# EAGLE design xenium-programmer-chip (EAGLE 9.6.2)
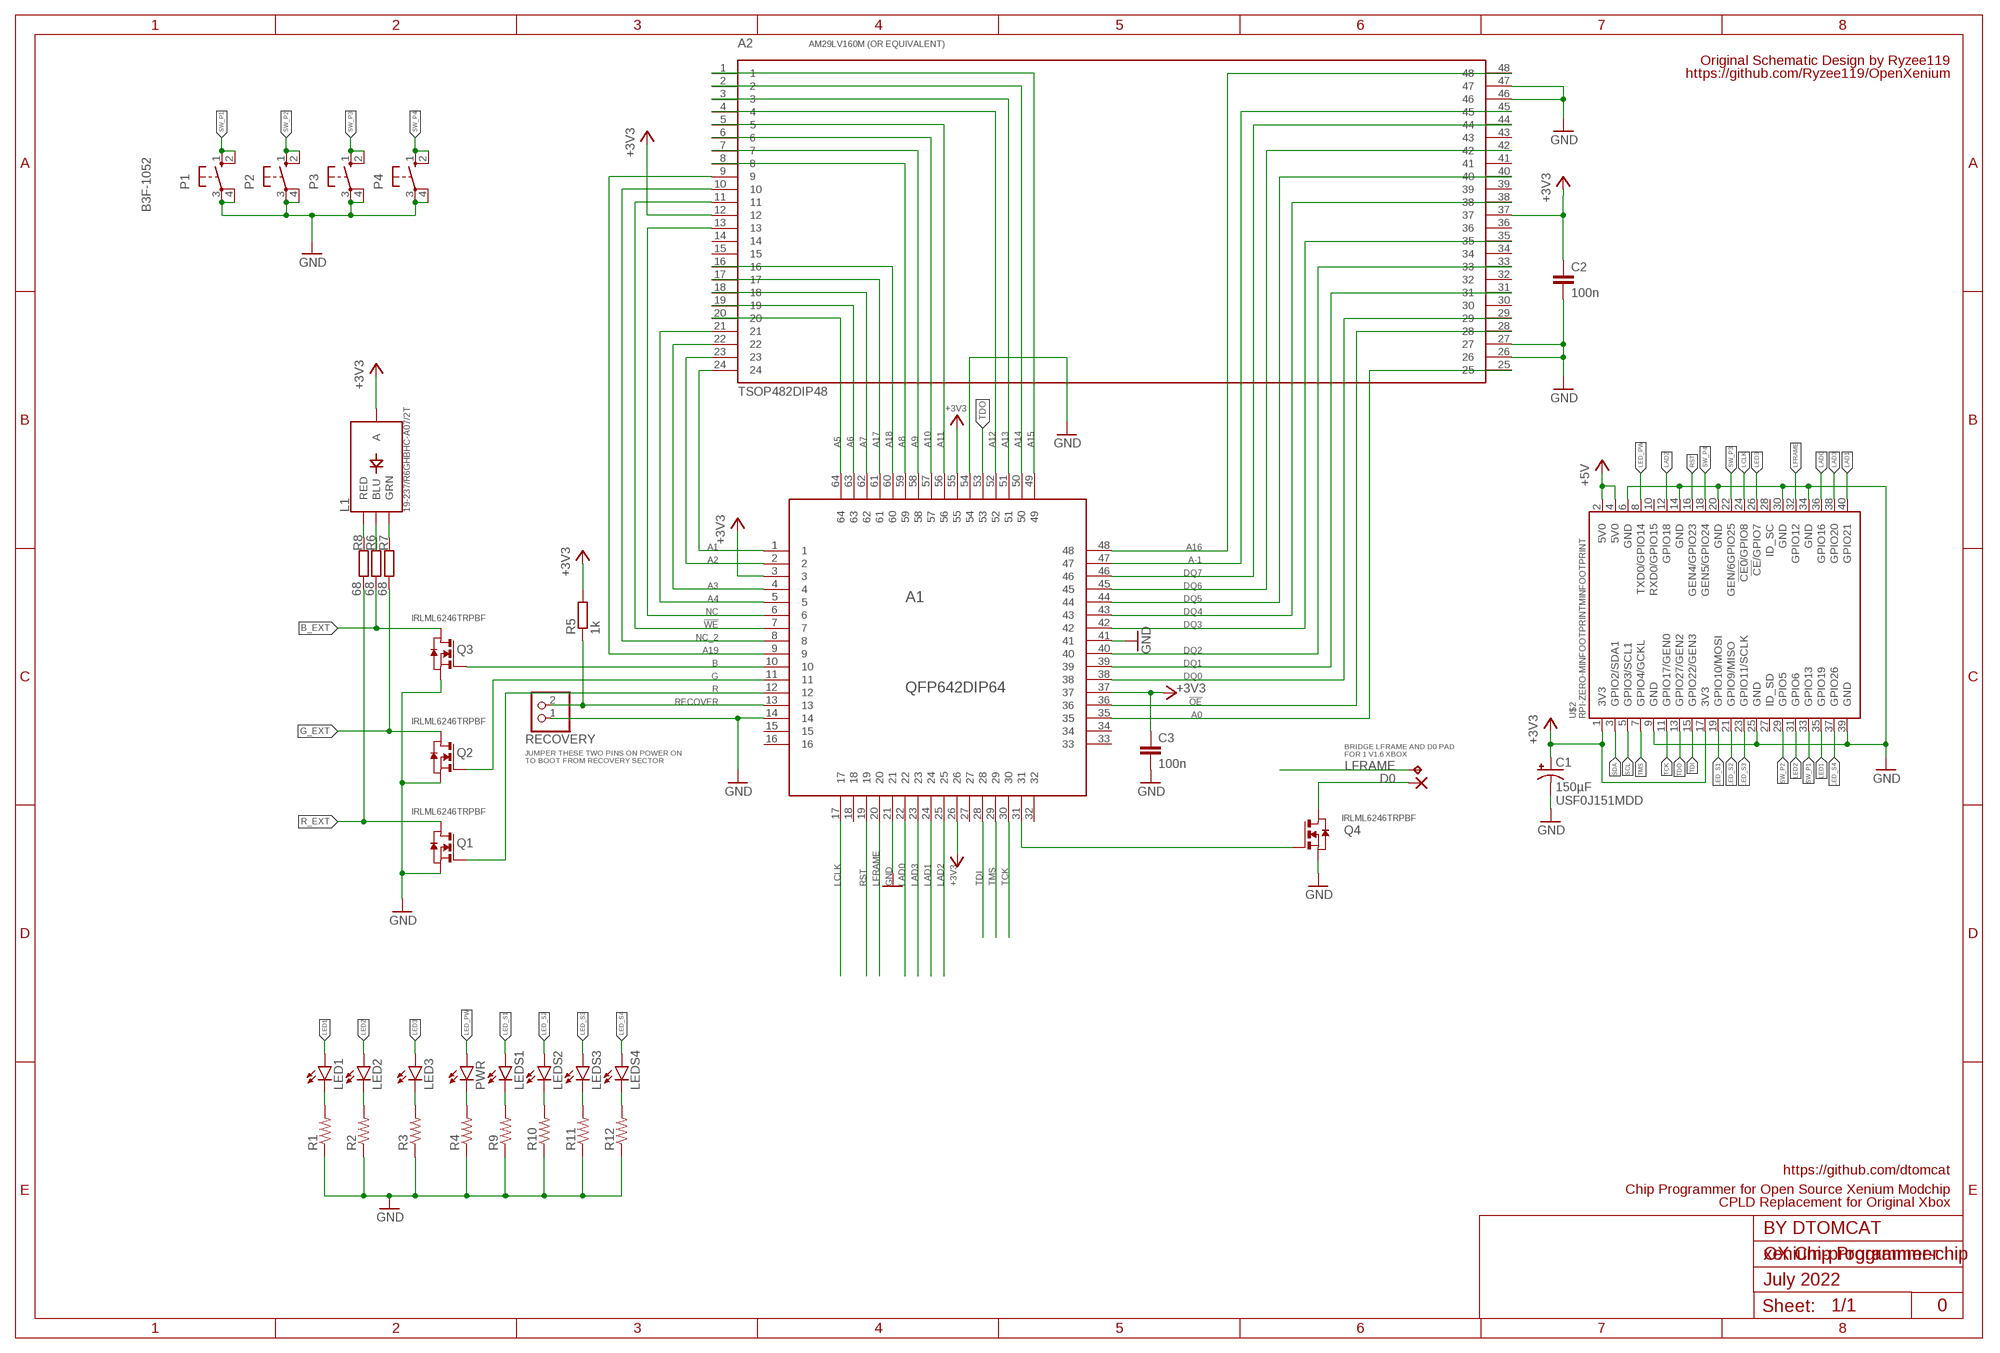
[diagram p0: schematic, sheet 1]

## Parts
A1  QFP642DIP64  [QFP642DIP64]
A2  TSOP482DIP48  [TSOP482DIP48]
C1  150µF  CPOL-USE3.5-8  [E3,5-8]
C2  100n  C-EUC0603  [C0603]
C3  100n  C-EUC0603  [C0603]
D0  SMD2  [SMD1,27-2,54]
L1  19-237/R6GHBHC-A07/2T  [4-SMD-R6GHBHC]
LED1  LEDCHIPLED_1206  [CHIPLED_1206]
LED2  LEDCHIPLED_1206  [CHIPLED_1206]
LED3  LEDCHIPLED_1206  [CHIPLED_1206]
LEDS1  LEDCHIPLED_1206  [CHIPLED_1206]
LEDS2  LEDCHIPLED_1206  [CHIPLED_1206]
LEDS3  LEDCHIPLED_1206  [CHIPLED_1206]
LEDS4  LEDCHIPLED_1206  [CHIPLED_1206]
P1  B3F-1052  [B3F-10XX]
P2  B3F-1052  [B3F-10XX]
P3  B3F-1052  [B3F-10XX]
P4  B3F-1052  [B3F-10XX]
PWR  LEDCHIPLED_1206  [CHIPLED_1206]
Q1  310mA/60V/1.6Ω  NMOSSOT23  [SOT-23]
Q2  310mA/60V/1.6Ω  NMOSSOT23  [SOT-23]
Q3  310mA/60V/1.6Ω  NMOSSOT23  [SOT-23]
Q4  310mA/60V/1.6Ω  NMOSSOT23  [SOT-23]
R1  R-US_R1206  [R1206]
R2  R-US_R1206  [R1206]
R3  R-US_R1206  [R1206]
R4  R-US_R1206  [R1206]
R5  1k  R-EU_R0603  [R0603]
R6  68  R-EU_R0603  [R0603]
R7  68  R-EU_R0603  [R0603]
R8  68  R-EU_R0603  [R0603]
R9  R-US_R1206  [R1206]
R10  R-US_R1206  [R1206]
R11  R-US_R1206  [R1206]
R12  R-US_R1206  [R1206]
RECOVERY  PINHD-1X2  [1X02]
TP1  TPTP13SQ  [TP13SQ]
U$2  RPI-ZERO-MINFOOTPRINTMINFOOTPRINT  [RASP_PI_ZERO_MIN]

## Nets
5V0@2: U$2.2(5V0) U$2.4(5V0) ; supply symbol labelled +5V
!OE: A1.36 A2.28
!WE: A1.7 A2.11
+3V3: A1.3 A1.26 A1.37 A1.55 A2.12 A2.37 C1.+ C2.1 C3.1 L1.P$2(A) R5.2 U$2.1(3V3) U$2.17(3V3)
A0: A1.35 A2.25
A1: A1.1 A2.24
A2: A1.2 A2.23
A3: A1.4 A2.22
A4: A1.5 A2.21
A5: A1.64 A2.20
A6: A1.63 A2.19
A7: A1.62 A2.18
A8: A1.59 A2.8
A9: A1.58 A2.7
A10: A1.57 A2.6
A11: A1.56 A2.5
A12: A1.52 A2.4
A13: A1.51 A2.3
A14: A1.50 A2.2
A15: A1.49 A2.1
A16: A1.48 A2.48
A17: A1.61 A2.17
A18: A1.60 A2.16
A19: A1.9 A2.9
A-1: A1.47 A2.45
B: A1.10 Q3.3(G)
B_EXT: Q3.1(D) R6.2
BLUE: L1.P$4(BLU) R6.1
DQ0: A1.38 A2.29
DQ1: A1.39 A2.31
DQ2: A1.40 A2.33
DQ3: A1.42 A2.35
DQ4: A1.43 A2.38
DQ5: A1.44 A2.40
DQ6: A1.45 A2.42
DQ7: A1.46 A2.44
G: A1.11 Q2.3(G)
G_EXT: Q2.1(D) R7.2
GND: A1.14 A1.21 A1.41 A1.54 A2.26 A2.27 A2.46 A2.47 C1.- C2.2 C3.2 P1.3(P) P1.4(P1) P2.3(P) P2.4(P1) P3.3(P) P3.4(P1) P4.3(P) P4.4(P1) Q1.2(S) Q2.2(S) Q3.2(S) Q4.2(S) R1.1 R2.1 R3.1 R4.1 R9.1 R10.1 R11.1 R12.1 RECOVERY.1 U$2.6(GND) U$2.9(GND) U$2.14(GND) U$2.20(GND) U$2.25(GND) U$2.30(GND) U$2.34(GND) U$2.39(GND)
GREEN: L1.P$3(GRN) R7.1
LAD0: A1.22 U$2.36(GPIO16)
LAD1: A1.24 U$2.40(GPIO21)
LAD2: A1.25 U$2.12(GPIO18)
LAD3: A1.23 U$2.38(GPIO20)
LCLK: A1.17 U$2.24(!CE0!/GPIO8)
LED1: LED1.A U$2.35(GPIO19)
LED2: LED2.A U$2.31(GPIO6)
LED3: LED3.A U$2.26(!CE!/GPIO7)
LED_PW: PWR.A U$2.8(TXD0/GPIO14)
LED_S1: LEDS1.A U$2.19(GPIO10/MOSI)
LED_S2: LEDS2.A U$2.21(GPIO9/MISO)
LED_S3: LEDS3.A U$2.23(GPIO11/SCLK)
LED_S4: LEDS4.A U$2.37(GPIO26)
LFRAME: A1.20 TP1.TP U$2.32(GPIO12)
N$1: LED1.C R1.2
N$2: LEDS1.C R9.2
N$3: LED2.C R2.2
N$4: LED3.C R3.2
N$5: PWR.C R4.2
N$10: LEDS2.C R10.2
N$12: LEDS3.C R11.2
N$14: LEDS4.C R12.2
N$37: A1.31 Q4.3(G)
N$51: D0.1(P) Q4.1(D)
NC: A1.6 A2.13
NC_2: A1.8 A2.10
R: A1.12 Q1.3(G)
R_EXT: Q1.1(D) R8.2
RECOVER: A1.13 R5.1 RECOVERY.2
RED: L1.P$1(RED) R8.1
RST: A1.19 U$2.16(GEN4/GPIO23)
SCL: U$2.5(GPIO3/SCL1)
SDA: U$2.3(GPIO2/SDA1)
SW_P1: P1.1(S) P1.2(S1) U$2.33(GPIO13)
SW_P2: P2.1(S) P2.2(S1) U$2.29(GPIO5)
SW_P3: P3.1(S) P3.2(S1) U$2.22(GEN/6GPIO25)
SW_P4: P4.1(S) P4.2(S1) U$2.18(GEN5/GPIO24)
TCK: A1.30 U$2.11(GPIO17/GEN0)
TDI: A1.28 U$2.15(GPIO22/GEN3)
TDO: A1.53 U$2.13(GPIO27/GEN2)
TMS: A1.29 U$2.7(GPIO4/GCKL)
Unconnected: A1.15 A1.16 A1.18 A1.27 A1.32 A1.33 A1.34 A2.14 A2.15 A2.30 A2.32 A2.34 A2.36 A2.39 A2.41 A2.43 U$2.10(RXD0/GPIO15) U$2.27(ID_SD) U$2.28(ID_SC)

## Notes on the sheet
- AM29LV160M (OR EQUIVALENT)
- Original Schematic Design by Ryzee119
- https://github.com/Ryzee119/OpenXenium
- IRLML6246TRPBF
- IRLML6246TRPBF
- BRIDGE LFRAME AND D0 PAD
  FOR 1 V1.6 XBOX
- JUMPER THESE TWO PINS ON POWER ON
  TO BOOT FROM RECOVERY SECTOR
- USF0J151MDD
- IRLML6246TRPBF
- IRLML6246TRPBF
- https://github.com/dtomcat
- Chip Programmer for Open Source Xenium Modchip
- CPLD Replacement for Original Xbox
- BY DTOMCAT
- OX Chip Programmer
- July 2022
- 0

## Library data of the parts
A1 = untitled:QFP642DIP64
A2 = untitled:TSOP482DIP48
C1 = rcl:CPOL-US: POLARIZED CAPACITOR, American symbol; SPICEPREFIX: C
C2 C3 = rcl:C-EU: CAPACITOR, European symbol; SPICEPREFIX: C
D0 = my-library:SMD2: SMD PAD
L1 = my-library:19-237/R6GHBHC-A07/2T
LED1-LED3 LEDS1-LEDS4 PWR = led:LED: LED OSRAM: - CHIPLED LG R971, LG N971, LY N971, LG Q971, LY Q971, LO R971, LY R971 LH N974, LH R974 LS Q976, LO Q976, LY Q976 LO Q996 - Hyper CHIPLED LW Q18S LB Q993, LB Q99A, LB R99A - SideLED LS A670, LO A670, LY A670, LG A670, LP A670 LB A673, LV A673, LT A673, LW A673 LH A674 LY A675 LS A676, LA A676, LO A676, LY A676, LW A676 LS A679, LY A679, LG A679 - Hyper Micro SIDELED® LS Y876, LA Y876, LO Y876, LY Y876 LT Y87S - SmartLED LW L88C, LW L88S LB L89C, LB L89S, LG L890 LS L89K, LO L89K, LY L89K LS L896, LA L896, LO L896, LY L896 - TOPLED LS T670, LO T670, LY T670, LG T670, LP T670 LSG T670, LSP T670, LSY T670, LOP T670, LYG T670 LG T671, LOG T671, LSG T671 LB T673, LV T673, LT T673, LW T673 LH T674 LS T676, LA T676, LO T676, LY T676, LB T676, LH T676, LSB T676, LW T676 LB T67C, LV T67C, LT T67C, LS T67K, LO T67K, LY T67K, LW E67C LS E67B, LA E67B, LO E67B, LY E67B, LB E67C, LV E67C, LT E67C LW T67C LS T679, LY T679, LG T679 LS T770, LO T770, LY T770, LG T770, LP T770 LB T773, LV T773, LT T773, LW T773 LH T774 LS E675, LA E675, LY E675, LS T675 LS T776, LA T776, LO T776, LY T776, LB T776 LHGB T686 LT T68C, LB T68C - Hyper Mini TOPLED® LB M676 - Mini TOPLED Santana® LG M470 LS M47K, LO M47K, LY M47K Source: http://www.osram.convergy.de LUXEON: - LUMILED® LXK2-PW12-R00, LXK2-PW12-S00, LXK2-PW14-U00, LXK2-PW14-V00 LXK2-PM12-R00, LXK2-PM12-S00, LXK2-PM14-U00 LXK2-PE12-Q00, LXK2-PE12-R00, LXK2-PE12-S00, LXK2-PE14-T00, LXK2-PE14-U00 LXK2-PB12-K00, LXK2-PB12-L00, LXK2-PB12-M00, LXK2-PB14-N00, LXK2-PB14-P00, LXK2-PB14-Q00 LXK2-PR12-L00, LXK2-PR12-M00, LXK2-PR14-Q00, LXK2-PR14-R00 LXK2-PD12-Q00, LXK2-PD12-R00, LXK2-PD12-S00 LXK2-PH12-R00, LXK2-PH12-S00 LXK2-PL12-P00, LXK2-PL12-Q00, LXK2-PL12-R00 Source: www.luxeon.com KINGBRIGHT: KA-3528ASYC Source: www.kingbright.com
P1-P4 = B3F-1052:B3F-1052: OMRON SWITCH 1.1mm holes; AVAILABILITY: Unavailable; DESCRIPTION: Tactile Switch; MF: Omron; MP: B3F-1052; PACKAGE: None; PRICE: None
Q1-Q4 = zetex:NMOSSOT23: MOS FET; OC_FARNELL: unknown; OC_NEWARK: unknown
R1-R4 R9-R12 = rcl:R-US_: RESISTOR, American symbol; SPICEPREFIX: R
R5-R8 = rcl:R-EU_: RESISTOR, European symbol; SPICEPREFIX: R
RECOVERY = pinhead:PINHD-1X2: PIN HEADER
TP1 = testpad:TP: Test pad
U$2 = rpi-zero:RPI-ZERO-MINFOOTPRINT

## Board
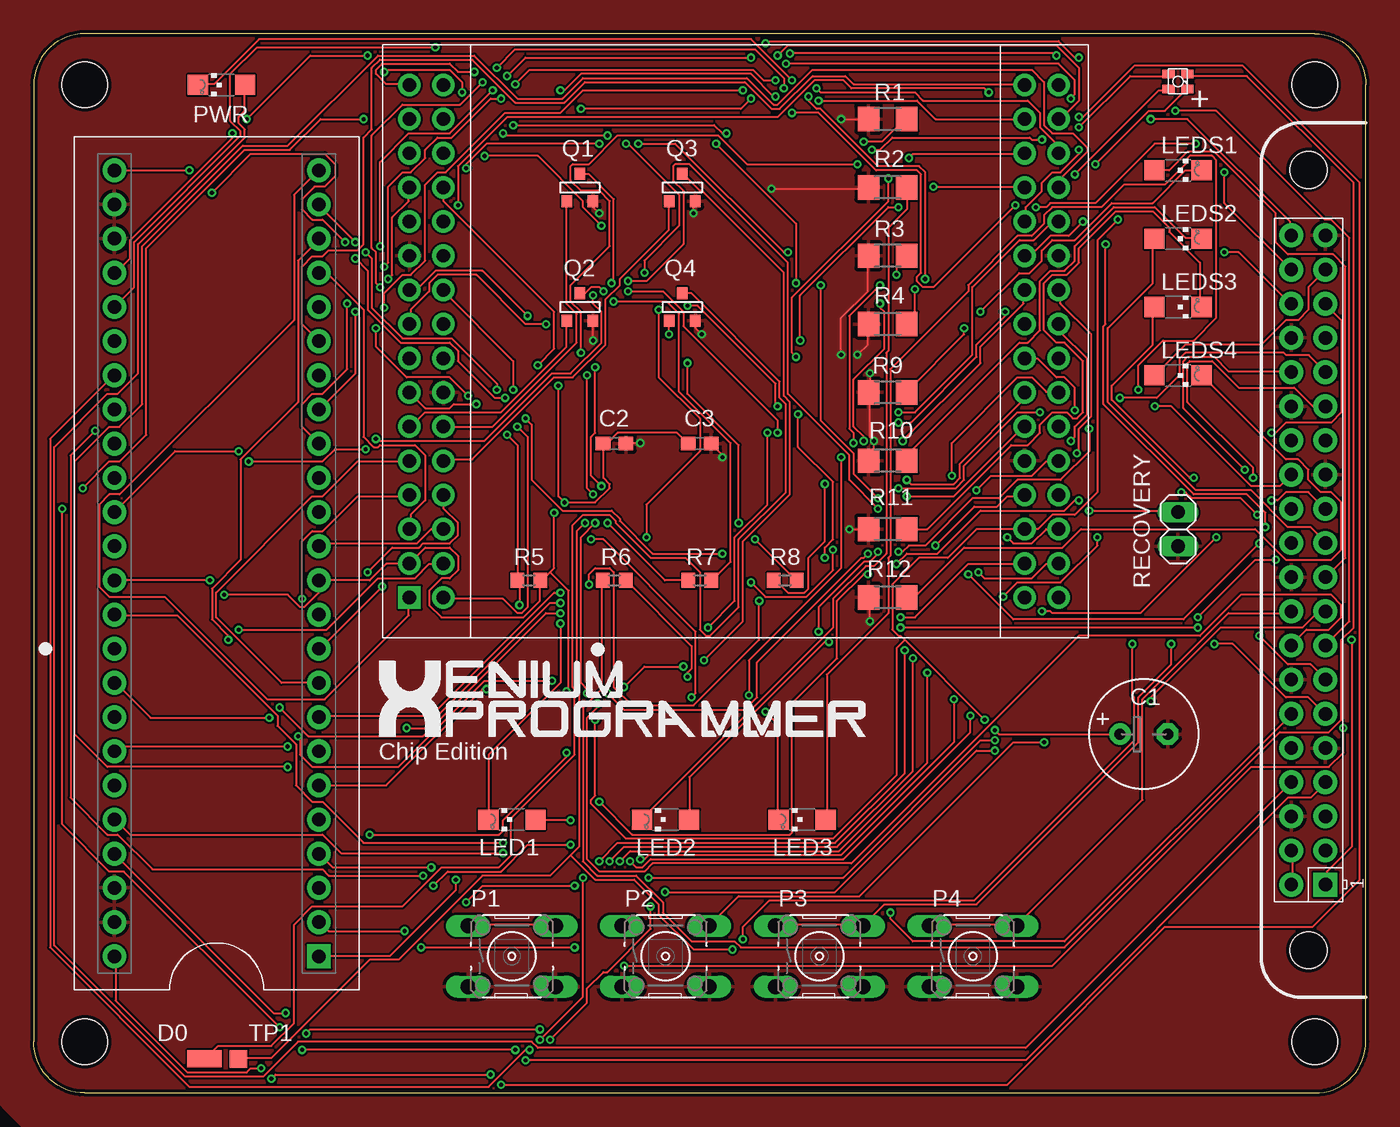
[diagram p1: board, top side]
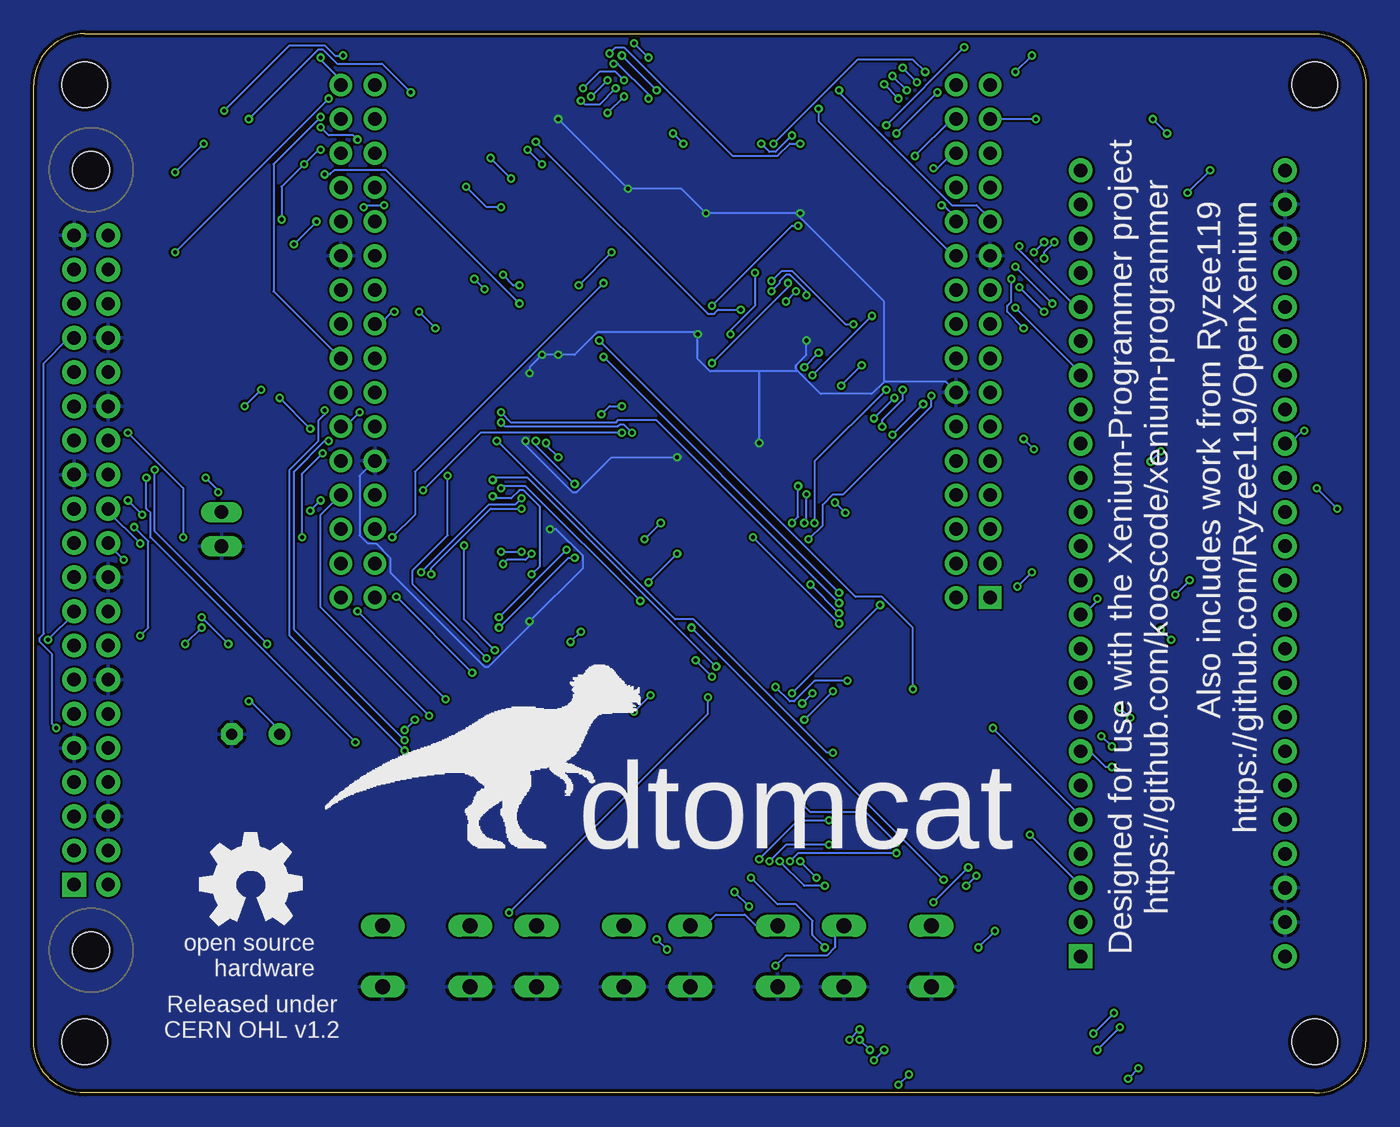
[diagram p2: board, bottom side, seen from below]

Size 99.06 x 78.74 mm. Coordinates in mm from the lower left corner, seen from the top.
Outline: 3.81,0 95.25,0 arc90 99.06,3.81 99.06,74.93 arc90 95.25,78.74 3.81,78.74 arc90 0,74.93 0,3.81 arc90 3.81,0
Copper layers (1*16): Top 0.035mm / dielectric 0.15mm / Bottom 0.035mm
Design rules "default": minimum track width 6mil, minimum drill 12mil, track to track 6mil, track to pad 6mil, pad to pad 6mil, via to via 6mil, smd to smd 0mil, copper to edge 10mil, drill to drill 10mil, minimum pad ring 10mil, minimum via ring 6mil, stop-mask expansion 2mil, vias tented up to drill 100mil, thermal gap 10mil
Holes 3.4 mm at 3.81,3.81 95.25,3.81 95.25,74.93 3.81,74.93

### Footprints (pad centres in the part's own frame; a part is rotated, then mirrored left to right if it is on the bottom)
QFP642DIP64 = drill 1 pad 1.676 square: 1 0,0 | drill 1 pad 1.676: 2 2.54,0; 3 0,2.54; 4 2.54,2.54; 5 0,5.08; 6 2.54,5.08; 7 0,7.62; 8 2.54,7.62; 9 0,10.16; 10 2.54,10.16; 11 0,12.7; 12 2.54,12.7; 13 0,15.24; 14 2.54,15.24; 15 0,17.78; 16 2.54,17.78; 17 0,20.32; 18 2.54,20.32; 19 0,22.86; 20 2.54,22.86; 21 0,25.4; 22 2.54,25.4; 23 0,27.94; 24 2.54,27.94; 25 0,30.48; 26 2.54,30.48; 27 0,33.02; 28 2.54,33.02; 29 0,35.56; 30 2.54,35.56; 31 0,38.1; 32 2.54,38.1; 33 45.74,0; 34 48.28,0; 35 45.74,2.54; 36 48.28,2.54; 37 45.74,5.08; 38 48.28,5.08; 39 45.74,7.62; 40 48.28,7.62; 41 45.74,10.16; 42 48.28,10.16; 43 45.74,12.7; 44 48.28,12.7; 45 45.74,15.24; 46 48.28,15.24; 47 45.74,17.78; 48 48.28,17.78; 49 45.74,20.32; 50 48.28,20.32; 51 45.74,22.86; 52 48.28,22.86; 53 45.74,25.4; 54 48.28,25.4; 55 45.74,27.94; 56 48.28,27.94; 57 45.74,30.48; 58 48.28,30.48; 59 45.74,33.02; 60 48.28,33.02; 61 45.74,35.56; 62 48.28,35.56; 63 45.74,38.1; 64 48.28,38.1
TSOP482DIP48 = drill 1 pad 1.778 square: 1 0,0 | drill 1 pad 1.778: 2 0,-2.54; 3 0,-5.08; 4 0,-7.62; 5 0,-10.16; 6 0,-12.7; 7 0,-15.24; 8 0,-17.78; 9 0,-20.32; 10 0,-22.86; 11 0,-25.4; 12 0,-27.94; 13 0,-30.48; 14 0,-33.02; 15 0,-35.56; 16 0,-38.1; 17 0,-40.64; 18 0,-43.18; 19 0,-45.72; 20 0,-48.26; 21 0,-50.8; 22 0,-53.34; 23 0,-55.88; 24 0,-58.42; 25 15.2,-58.42; 26 15.2,-55.88; 27 15.2,-53.34; 28 15.2,-50.8; 29 15.2,-48.26; 30 15.2,-45.72; 31 15.2,-43.18; 32 15.2,-40.64; 33 15.2,-38.1; 34 15.2,-35.56; 35 15.2,-33.02; 36 15.2,-30.48; 37 15.2,-27.94; 38 15.2,-25.4; 39 15.2,-22.86; 40 15.2,-20.32; 41 15.2,-17.78; 42 15.2,-15.24; 43 15.2,-12.7; 44 15.2,-10.16; 45 15.2,-7.62; 46 15.2,-5.08; 47 15.2,-2.54; 48 15.2,0
E3,5-8 = drill 0.813 pad 1.6: + -1.778,0 | drill 0.813 pad 1.6 octagon: - 1.778,0
C0603 = smd 1.1 x 1: 1 -0.85,0; 2 0.85,0
SMD1,27-2,54 = smd 1.27 x 2.54: 1 0,0
4-SMD-R6GHBHC = smd 0.9 x 0.65: P$1 -0.7,-0.55; P$2 0.7,-0.55; P$3 -0.7,0.55; P$4 0.7,0.55
CHIPLED_1206 = smd 1.5 x 1.5: A 0,-1.75; C 0,1.75
B3F-10XX = drill 1.1 long: 1 -3.251,2.261; 2 3.251,2.261; 3 -3.251,-2.261; 4 3.251,-2.261
SOT-23 = smd 0.787 x 0.889: 1 0.025,-1.016; 2 -0.94,1.016; 3 0.991,1.016
R1206 = smd 1.6 x 1.803: 1 -1.422,0; 2 1.422,0
R0603 = smd 1 x 1.1: 1 -0.85,0; 2 0.85,0
1X02 = drill 1.016 long: 1 -1.27,0; 2 1.27,0
TP13SQ = smd 1.3 x 1.3: TP 0,0
RASP_PI_ZERO_MIN = drill 1 pad 1.778 square: 1 -0.52,-0.17 | drill 1 pad 1.778: 2 -0.52,2.37; 3 2.02,-0.17; 4 2.02,2.37; 5 4.56,-0.17; 6 4.56,2.37; 7 7.1,-0.17; 8 7.1,2.37; 9 9.64,-0.17; 10 9.64,2.37; 11 12.18,-0.17; 12 12.18,2.37; 13 14.72,-0.17; 14 14.72,2.37; 15 17.26,-0.17; 16 17.26,2.37; 17 19.8,-0.17; 18 19.8,2.37; 19 22.34,-0.17; 20 22.34,2.37; 21 24.88,-0.17; 22 24.88,2.37; 23 27.42,-0.17; 24 27.42,2.37; 25 29.96,-0.17; 26 29.96,2.37; 27 32.5,-0.17; 28 32.5,2.37; 29 35.04,-0.17; 30 35.04,2.37; 31 37.58,-0.17; 32 37.58,2.37; 33 40.12,-0.17; 34 40.12,2.37; 35 42.66,-0.17; 36 42.66,2.37; 37 45.2,-0.17; 38 45.2,2.37; 39 47.74,-0.17; 40 47.74,2.37 | hole 2.75: -5.39,1.1; 52.61,1.1

### Placement (x,y rotation side)
A1  27.94,36.83 0 top
A2  21.21,10.16 180 top
C1  82.55,26.67 0 top
C2  43.18,48.26 0 top
C3  49.53,48.26 0 top
D0  12.7,2.54 270 top
L1  85.09,75.18 0 top
LED1  35.56,20.32 90 top
LED2  46.99,20.32 90 top
LED3  57.15,20.32 90 top
LEDS1  85.09,68.58 270 top
LEDS2  85.09,63.5 270 top
LEDS3  85.09,58.42 270 top
LEDS4  85.09,53.34 270 top
P1  35.56,10.16 0 top
P2  46.99,10.16 0 top
P3  58.42,10.16 0 top
P4  69.85,10.16 0 top
PWR  13.97,74.93 90 top
Q1  40.64,67.31 180 top
Q2  40.64,58.42 180 top
Q3  48.26,67.31 180 top
Q4  48.26,58.42 180 top
R1  63.5,72.39 0 top
R2  63.5,67.31 0 top
R3  63.5,62.23 0 top
R4  63.5,57.15 0 top
R5  36.83,38.1 0 top
R6  43.18,38.1 0 top
R7  49.53,38.1 0 top
R8  55.88,38.1 0 top
R9  63.5,52.07 0 top
R10  63.5,46.99 0 top
R11  63.5,41.91 0 top
R12  63.5,36.83 0 top
RECOVERY  85.09,41.91 90 top
TP1  15.24,2.54 0 top
U$1  [OSHW_8MM]  82.93,15.49 0 bottom
U$2  95.89,16 90 top

### Tracks (layer width: path | path; a pad name or v marks a point on that pad's centre or on a via)
5V0@2
  Top 0.152: U$2.2 93.57,15.54 93.57,17.98 U$2.4
!OE  (via drill 0.3)
  Top 0.152: v70.26,38.71 70.71,38.25 74.22,38.25 75.29,39.32 76.2,39.32 A1.36 | v62.79,44.2 60.96,46.02 60.96,47.55 58.52,49.99 v58.52,60.05 | v56.08,62.48 55.78,62.48 47.7,70.56 v44.96,70.56 | v42.67,71.17 35.05,71.17 v34.9,71.32 | v31.85,74.37 31.85,75.13 30.94,76.05 26.21,76.05 v26.06,75.89 | v24.84,77.11 20.57,77.11 v15.85,72.39 | v14.78,71.32 14.78,71.02 7.16,63.4 7.16,62.03 6.1,60.96 A2.28
  Bottom 0.152: v70.26,38.71 65.23,43.74 63.25,43.74 v62.79,44.2 | v56.08,62.48 v58.52,60.05 | v44.96,70.56 44.35,69.95 43.89,69.95 v42.67,71.17 | v31.85,74.37 v34.9,71.32 | v24.84,77.11 v26.06,75.89 | v14.78,71.32 v15.85,72.39
!WE  (via drill 0.3)
  Top 0.152: v19.96,36.73 19.96,41 20.73,41.76 21.49,41.76 24.08,44.35 27.89,44.35 A1.7
  Bottom 0.152: v19.96,36.73 19.96,36.58 20.88,35.66 21.18,35.66 A2.11
+3V3  (via drill 0.3)
  Top 0.152: v13.11,38.1 A2.37 | v14.17,37.03 18.9,37.03 19.81,36.12 20.12,36.12 21.18,37.19 21.18,38.1 A2.12 24.99,38.1 26.21,39.32 27.89,39.32 A1.3 29.11,40.54 30.94,40.54 31.55,39.93 31.55,38.86 30.94,38.25 30.33,38.25 29.41,37.34 29.41,36.27 30.33,35.36 36.42,35.36 37.64,36.58 37.64,38.1 R5.2 37.8,38.1 38.41,38.71 | C3.1 48.62,48.31 47.85,49.07 43.43,49.07 42.67,48.31 42.37,48.31 C2.1 42.37,48.16 42.37,45.72 42.82,45.26 42.82,44.96 41.76,43.89 v39.47,43.89 39.01,44.35 v39.01,52.58 | v38.71,43.13 38.71,39.01 38.41,38.71 | A1.26 30.48,66.29 38.71,58.06 38.71,55.32 v37.49,54.1 | v83.06,29.11 83.06,29.41 88.24,34.59 94.34,34.59 95.4,35.66 96.01,35.66 U$2.17 | v97.99,33.68 97.99,18.29 96.16,16.46 96.16,15.54 U$2.1 | v78.94,69.04 82.91,73 84.12,73 85.65,74.52 L1.P$2 | v77.72,70.1 77.72,69.8 76.35,68.43 75.74,68.43 74.95,67.64 74.95,67.03 73.76,65.84 73.76,64.77 A1.55 | v80.62,64.92 79.1,63.4 79.1,44.65 77.42,42.98 75.74,42.98 74.68,41.91 A1.37 70.1,41.91 67.97,39.78 65.84,39.78 63.86,37.8 63.86,34.44 64.31,33.98 64.47,33.98 64.77,33.68 | C1.+ 71.78,26.67 v71.48,26.98 | 64.77,33.68 v70.71,27.74 | 38.41,38.71 39.78,37.34 39.78,30.02 v39.62,29.87 | v41.76,27.74 41.76,22.1 41.45,21.79 41.45,21.49 44.04,18.9 59.44,18.9 64.16,23.62 64.16,33.07 64.77,33.68
  Bottom 0.152: v14.17,37.03 v13.11,38.1 | v38.71,43.13 v39.47,43.89 | v39.01,52.58 v37.49,54.1 | C1.+ 80.77,26.98 82.91,29.11 v83.06,29.11 | v97.99,33.68 96.01,35.66 U$2.17 | v77.72,70.1 77.88,70.1 v78.94,69.04 80.62,67.36 v80.62,64.92 | v70.71,27.74 v71.48,26.98 | v41.76,27.74 v39.62,29.87
A0  (via drill 0.3)
  Top 0.152: v64.47,35.36 65.53,35.36 69.49,39.32 73.61,39.32 A1.35 | v59.44,40.39 59.44,38.86 57.45,36.88 54.41,36.88 v53.34,37.95 | v51.21,40.08 46.02,40.08 43.59,42.52 43.59,42.67 42.98,43.28 39.32,43.28 37.03,45.57 37.03,49.68 v36.58,50.14 | v35.05,51.66 34.29,51.66 31.55,54.41 31.55,55.17 30.94,55.78 27.28,55.78 24.84,58.22 24.84,61.11 v23.93,62.03 | v23.16,63.25 21.49,64.92 20.73,64.92 19.96,65.68 19.96,66.45 20.88,67.36 21.64,67.36 22.4,68.12 22.4,69.04 21.64,69.8 16.15,69.8 v13.26,66.9 | A2.25 v11.58,68.58
  Bottom 0.152: v59.44,40.39 v64.47,35.36 | v51.21,40.08 v53.34,37.95 | v35.05,51.66 v36.58,50.14 | v23.93,62.03 23.93,62.48 v23.16,63.25 | v11.58,68.58 v13.26,66.9
A1
  Top 0.152: A1.1 27.89,36.73 27.89,35.51 21.64,29.26 17.37,29.26 9.75,36.88 5.64,36.88 4.88,37.64 4.88,43.74 5.64,44.5 6.4,44.5 19.36,57.45 19.36,66.75 21.18,68.58 A2.24
A2  (via drill 0.3)
  Top 0.152: v35.97,49.53 36.73,48.77 36.73,36.12 36.27,35.66 35.97,35.66 34.9,36.73 30.48,36.73 A1.2 | v34.44,52.27 34.44,52.73 31.09,56.08 27.43,56.08 25.15,58.37 25.15,62.03 v24.69,62.48 | v23.93,63.25 21.18,65.99 A2.23
  Bottom 0.152: v35.97,49.53 35.97,49.99 34.44,51.51 v34.44,52.27 | v23.93,63.25 v24.69,62.48
A3  (via drill 0.3)
  Top 0.152: v15.24,34.44 21.79,34.44 25.6,38.25 28.35,38.25 29.41,39.32 30.48,39.32 A1.4 | v14.48,33.68 14.48,33.98 13.26,35.2 13.26,37.49 15.39,39.62 15.39,47.09 19.66,51.36 19.66,61.87 21.18,63.4 A2.22
  Bottom 0.152: v14.48,33.68 v15.24,34.44
A4
  Top 0.152: A2.21 21.79,60.96 24.54,58.22 24.54,48.77 25.3,48.01 25.6,48.01 25.76,48.16 28.35,48.16 29.11,47.4 29.11,44.04 28.04,42.98 28.04,41.91 A1.5
A5  (via drill 0.3)
  Top 0.152: v77.72,76.96 77.42,76.96 76.2,78.18 54.56,78.18 v54.41,78.03 | v53.34,76.96 36.58,76.96 v35.2,75.59 | v34.14,74.52 30.94,71.32 27.89,71.32 25.76,69.19 v25.76,62.94
  Bottom 0.152: v77.72,76.96 77.72,76.81 76.35,75.44 76.35,74.98 A1.64 | v53.34,76.96 v54.41,78.03 | v34.14,74.52 v35.2,75.59 | v25.76,62.94 25.76,62.64 21.64,58.52 21.34,58.52 A2.20
A6
  Top 0.152: A1.63 73.61,74.98 60.96,74.98 60.35,75.59 57.91,75.59 55.47,73.15 54.86,73.15 52.88,75.13 41,75.13 39.47,73.61 35.81,73.61 32.61,76.81 25.76,76.81 25.15,76.2 25.15,71.63 24.54,71.02 24.54,63.09 24.08,62.64 21.95,62.64 21.49,62.18 20.73,62.18 19.96,61.42 19.96,57.15 21.18,55.93 A2.19
A7  (via drill 0.3)
  Top 0.152: v55.32,77.11 56.08,77.88 76.05,77.88 77.72,76.2 77.72,73.76 76.35,72.39 A1.62 | v52.73,74.52 40.84,74.52 39.17,72.85 35.05,72.85 30.63,68.43 30.02,68.43 29.11,67.51 29.11,61.87 28.04,60.81 27.43,60.81 26.06,59.44 v26.06,58.37
  Bottom 0.152: v52.73,74.52 v55.32,77.11 | v26.06,58.37 21.34,53.65 21.34,53.34 A2.18
A8  (via drill 0.3)
  Top 0.152: v65.08,69.49 65.38,69.8 73.61,69.8 A1.59 | v63.55,67.97 63.55,66.29 56.39,59.13 56.39,55.02 v56.69,54.71 | v39.17,37.19 38.71,37.19 29.57,28.04 21.34,28.04 A2.8
  Bottom 0.152: v63.55,67.97 v65.08,69.49 | v39.17,37.19 v56.69,54.71
A9  (via drill 0.3)
  Top 0.152: v18.9,24.23 5.49,24.23 3.05,26.67 3.05,46.94 5.61,49.51 6.38,49.51 8.08,51.21 8.08,62.94 15.54,70.41 18.9,70.41 25.6,77.11 32.77,77.11 35.97,73.91 39.32,73.91 40.84,75.44 53.03,75.44 55.02,73.46 55.32,73.46 57.91,76.05 74.22,76.05 75.13,75.13 75.13,71.93 75.74,71.32 77.27,71.32 78.33,70.26 78.33,69.95 76.35,67.97 76.35,67.36 A1.58
  Bottom 0.152: v18.9,24.23 19.36,24.23 20.42,25.3 21.18,25.3 A2.7
A10  (via drill 0.3)
  Top 0.152: v66.9,67.36 73.61,67.36 A1.57 | v64.31,65.84 63.55,65.84 57,59.28 v57,55.93 | v33.68,30.02 33.38,30.02 26.21,22.86 A2.6
  Bottom 0.152: v66.9,67.36 65.38,65.84 v64.31,65.84 | v57,55.93 37.95,36.88 35.97,36.88 33.68,34.59 v33.68,30.02
A11  (via drill 0.3)
  Top 0.152: A1.56 75.74,64.77 74.37,63.4 73.3,63.4 69.8,59.89 69.8,54.86 65.53,50.6 v64.31,50.6 | v39.17,36.42 38.41,36.42 29.11,27.13 v27.74,27.13
  Bottom 0.152: v64.31,50.6 63.55,49.84 55.78,49.84 55.63,49.99 52.73,49.99 v39.17,36.42 | v27.74,27.13 21.34,20.73 21.34,20.42 A2.5
A12  (via drill 0.3)
  Top 0.152: v77.57,47.55 77.72,47.7 77.72,49.38 78.64,50.29 78.64,56.39 76.35,58.67 76.35,59.59 A1.52 | v79.1,41.3 79.1,40.69 76.35,37.95 73.15,37.95 v72.08,36.88 | v66.45,31.24 66.45,24.54 59.89,17.98 44.35,17.98 v43.59,17.22 | v40.23,15.39 33.38,15.39 v32.16,14.17 | v29.57,16.76 22.25,16.76 21.34,17.68 A2.4
  Bottom 0.152: v77.57,47.55 79.1,46.02 v79.1,41.3 | v66.45,31.24 v72.08,36.88 | v43.59,17.22 41.76,15.39 v40.23,15.39 | v29.57,16.76 v32.16,14.17
A13  (via drill 0.3)
  Top 0.152: v64.62,48.46 70.41,54.25 70.41,55.47 73.61,58.67 73.61,59.59 A1.51 | v39.62,25.3 39.62,24.99 34.9,20.27 34.9,19.51 34.59,19.2 v24.99,19.2
  Bottom 0.152: v64.62,48.46 51.36,35.2 49.99,35.2 40.08,25.3 v39.62,25.3 | v24.99,19.2 21.34,15.54 21.34,15.24 A2.3
A14  (via drill 0.3)
  Top 0.152: v77.11,48.46 77.42,48.77 77.42,49.53 78.33,50.44 78.33,54.56 76.35,56.54 76.35,57.15 A1.50 | v71.48,26.21 70.41,26.21 60.2,16 v45.72,16 | v28.8,10.82 v40.23,10.82 | v27.58,12.04 21.95,12.04 21.34,12.65 A2.2
  Bottom 0.152: v77.11,48.46 77.42,48.46 79.7,46.18 79.7,34.44 v71.48,26.21 | v45.72,16 43.74,14.02 42.37,14.02 41.15,12.8 41.15,11.73 v40.23,10.82 | v27.58,12.04 v28.8,10.82
A15  (via drill 0.3)
  Top 0.152: v72.24,58.06 72.24,57.76 70.1,55.63 70.1,54.71 65.23,49.84 v64.31,49.84 | v54.56,49.07 54.56,43.74 52.12,41.3 52.12,36.58 v50.14,34.59 | v31.39,15.85 31.39,15.09 26.52,10.21 21.34,10.21 A2.1
  Bottom 0.152: A1.49 73.3,57.15 72.39,58.06 v72.24,58.06 | v64.31,49.84 64.01,49.53 55.63,49.53 55.47,49.68 55.17,49.68 v54.56,49.07 | v31.39,15.85 v50.14,34.59
A16  (via drill 0.3)
  Top 0.152: v77.72,72.54 78.03,72.54 81.84,76.35 89.92,76.35 98.6,67.67 98.6,15.85 95.1,12.34 84.12,12.34 72.39,0.61 v34.75,0.61 | v33.98,1.37 17.98,1.37 v17.68,1.07 | v16.92,1.83 16.15,1.83 15.85,1.52 11.43,1.52 6.1,6.86 6.1,10.06 A2.48
  Bottom 0.152: v77.72,72.54 81.23,69.04 81.23,59.59 76.35,54.71 A1.48 | v33.98,1.37 v34.75,0.61 | v16.92,1.83 v17.68,1.07
A17  (via drill 0.3)
  Top 0.152: A1.61 67.06,72.39 65.68,73.76 v58.37,73.76 | v55.78,74.68 55.78,75.44 53.65,77.57 35.81,77.57 v34.44,76.2 | v33.38,75.13 31.7,73.46 27.43,73.46 25.15,71.17 25.15,62.79 25.45,62.48 25.45,60.2 v25.76,59.89 | v23.93,58.06 23.93,53.49 21.34,50.9 A2.17
  Bottom 0.152: v58.37,73.76 58.06,73.46 57,73.46 v55.78,74.68 | v33.38,75.13 v34.44,76.2 | v23.93,58.06 v25.76,59.89
A18  (via drill 0.3)
  Top 0.152: v58.22,74.68 58.52,74.37 65.53,74.37 66.14,73.76 73.91,73.76 74.83,72.85 74.83,71.78 76.2,70.41 76.2,69.95 A1.60 | v55.17,75.29 54.25,75.29 53.49,76.05 36.88,76.05 v35.81,74.98 | v34.75,73.91 33.98,73.91 31.09,71.02 30.02,71.02 29.11,70.1 29.11,69.49 28.04,68.43 27.43,68.43 26.36,67.36 26.36,61.72 v26.06,61.42 | v23.32,58.67 23.32,53.8 21.49,51.97 20.73,51.97 19.96,51.21 19.96,49.53 21.18,48.31 A2.16
  Bottom 0.152: v58.22,74.68 57,75.89 55.78,75.89 v55.17,75.29 | v34.75,73.91 v35.81,74.98 | v23.32,58.67 v26.06,61.42
A19
  Top 0.152: A2.9 18.44,30.48 13.56,35.36 13.56,37.19 20.73,44.35 21.49,44.35 24.08,46.94 27.89,46.94 A1.9
A-1  (via drill 0.3)
  Top 0.152: v77.42,50.75 77.42,52.43 76.66,53.19 76.05,53.19 74.68,54.56 73.76,54.56 A1.47 | v71.48,25.45 70.1,25.45 59.59,14.94 v46.94,14.94 | v45.87,13.87 45.87,12.19 42.67,8.99 42.37,8.99 41.15,7.77 41.15,6.71 v38.41,3.96 | v37.64,4.72 20.57,4.72 v20.27,4.42 | v18.75,5.94 17.83,5.94 6.1,17.68 A2.45
  Bottom 0.152: v77.42,50.75 77.42,50.44 77.88,49.99 77.88,48.46 80.01,46.33 80.01,33.98 v71.48,25.45 | v45.87,13.87 v46.94,14.94 | v37.64,4.72 v38.41,3.96 | v18.75,5.94 v20.27,4.42
B
  Top 0.152: Q3.3 47.24,66.29 47.24,64.16 43.59,60.5 43.59,60.05 42.52,58.98 42.52,55.63 40.08,53.19 38.71,53.19 32.61,47.09 30.48,47.09 A1.10
B_EXT  (via drill 0.3)
  Top 0.152: v49.84,32.16 52.73,35.05 52.73,41 56.24,44.5 56.24,51.36 55.78,51.82 55.78,60.96 49.68,67.06 49.53,67.06 48.31,68.28 Q3.1 | v48.62,30.94 48.62,31.24 48.92,31.55 48.92,33.22 44.04,38.1 R6.2
  Bottom 0.152: v48.62,30.94 v49.84,32.16
BLUE
  Top 0.152: L1.P$4 85.8,75.59 90.22,75.59 98.15,67.67 98.15,34.59 97.23,33.68 97.23,27.74 96.32,26.82 92.66,26.82 76.66,10.82 52.58,10.82 52.12,11.28 48.92,11.28 46.79,13.41 46.79,14.17 44.81,16.15 41.91,16.15 40.84,17.22 40.84,28.65 42.22,30.02 42.22,38.1 R6.1
DQ0  (via drill 0.3)
  Top 0.152: A1.38 75.29,41.91 74.22,40.84 72.85,40.84 v72.39,41.3 | v56.69,60.2 56.69,64.62 v50.75,70.56 | v51.51,71.32 51.21,71.32 50.6,71.93 v35.66,71.93 | v29.87,77.72 16.61,77.72 14.63,75.74 14.63,72.24 15.39,71.48 15.39,71.17 7.47,63.25 7.47,59.89 6.1,58.52 A2.29
  Bottom 0.152: v72.39,41.3 70.71,42.98 70.71,46.18 v56.69,60.2 | v51.51,71.32 v50.75,70.56 | v29.87,77.72 v35.66,71.93
DQ1  (via drill 0.3)
  Top 0.152: v67.06,40.69 69.95,43.59 71.63,43.59 72.39,44.35 73.61,44.35 A1.39 | v64.77,32.92 64.77,23.77 59.59,18.59 43.43,18.59 v42.06,17.22 | v40.84,16 40.84,7.16 v37.64,3.96 | v36.88,3.2 36.58,3.2 33.83,0.46 11.58,0.46 1.22,10.82 1.22,48.62 5.94,53.34 A2.31
  Bottom 0.152: v67.06,40.69 67.06,35.2 v64.77,32.92 | v40.84,16 v42.06,17.22 | v36.88,3.2 v37.64,3.96
DQ2  (via drill 0.3)
  Top 0.152: v69.65,28.04 69.65,26.82 60.2,17.37 45.87,17.37 45.26,16.76 44.81,16.76 v44.35,17.22 | v39.93,18.44 36.73,18.44 34.75,16.46 30.79,16.46 v29.72,15.39 | v28.96,16.15 21.95,16.15 21.49,16.61 8.84,16.61 6.25,19.2 5.49,19.2 2.74,21.95 2.74,47.4 v4.57,49.23
  Bottom 0.152: v69.65,28.04 77.72,36.12 77.72,42.98 76.35,44.35 A1.40 | v44.35,17.22 43.13,18.44 v39.93,18.44 | v28.96,16.15 v29.72,15.39 | v4.57,49.23 4.72,49.23 5.64,48.31 5.94,48.31 A2.33
DQ3  (via drill 0.3)
  Top 0.152: v70.1,44.81 71.17,45.87 74.22,45.87 75.29,46.94 76.2,46.94 A1.42 | v55.32,49.07 55.32,49.99 48.31,57 48.31,58.06 46.79,59.59 v44.2,59.59 | v41.6,59.28 41.6,58.67 42.22,58.06 42.22,55.78 39.93,53.49 38.56,53.49 33.53,48.46 25.6,48.46 v25.45,48.62 | v24.69,47.85 22.4,47.85 21.49,46.94 v16,46.94 | v15.24,47.7 10.52,47.7 6.1,43.28 A2.35
  Bottom 0.152: v70.1,44.81 65.84,49.07 v55.32,49.07 | v44.2,59.59 43.59,60.2 43.59,60.35 43.13,60.81 42.82,60.81 41.6,59.59 v41.6,59.28 | v24.69,47.85 v25.45,48.62 | v15.24,47.7 v16,46.94
DQ4  (via drill 0.3)
  Top 0.152: v64.92,44.35 68.43,44.35 73.61,49.53 A1.43 | v62.03,38.56 61.72,38.56 59.74,36.58 59.74,32.31 56.39,28.96 56.39,19.36 56.24,19.2 44.5,19.2 v42.06,21.64 | v34.9,18.59 24.54,18.59 21.49,21.64 20.73,21.64 19.51,22.86 19.51,25.91 18.14,27.28 18.14,28.04 10.67,35.51 6.1,35.51 A2.38
  Bottom 0.152: v64.92,44.35 64.77,44.2 63.55,44.2 62.94,44.81 62.64,44.81 61.42,43.59 61.42,39.17 v62.03,38.56 | v42.06,21.64 41.3,20.88 37.19,20.88 v34.9,18.59
DQ5  (via drill 0.3)
  Top 0.152: v74.83,50.6 73.15,50.6 69.19,46.63 69.19,45.57 68.58,44.96 v64.31,44.96 | v53.95,36.58 53.95,33.68 49.07,28.8 44.5,28.8 43.13,30.18 43.13,38.71 42.82,39.01 41.76,39.01 41.3,38.56 v41.3,37.8 | v39.17,35.66 38.1,35.66 28.96,26.52 20.42,26.52 v18.29,28.65 | v17.53,27.89 8.69,27.89 6.1,30.48 A2.40
  Bottom 0.152: A1.44 75.89,49.53 v74.83,50.6 | v64.31,44.96 64.16,45.11 62.48,45.11 v53.95,36.58 | v39.17,35.66 v41.3,37.8 | v17.53,27.89 v18.29,28.65
DQ6  (via drill 0.3)
  Top 0.152: v64.92,45.57 65.23,45.26 68.43,45.26 68.89,45.72 68.89,46.79 73.61,51.51 73.61,51.97 A1.45 | v48.31,31.7 45.41,31.7 v43.89,30.18 | v38.56,30.63 33.53,30.63 27.13,24.23 20.73,24.23 19.81,25.15 19.81,26.36 v19.66,26.52 | v18.9,25.76 6.4,25.76 6.1,25.45 A2.42
  Bottom 0.152: v64.92,45.57 64.77,45.72 62.33,45.72 v48.31,31.7 | v43.89,30.18 42.82,29.11 42.52,29.11 41,30.63 v38.56,30.63 | v18.9,25.76 v19.66,26.52
DQ7  (via drill 0.3)
  Top 0.152: v68.28,45.87 68.28,48.31 73.15,53.19 74.22,53.19 75.29,52.12 76.2,52.12 A1.46 | v65.38,32.31 65.38,23.93 59.74,18.29 43.89,18.29 v42.82,17.22 | v34.9,17.83 22.86,17.83 21.49,19.2 7.16,19.2 6.1,20.27 A2.44
  Bottom 0.152: v68.28,45.87 68.28,41.45 70.87,38.86 70.87,37.8 v65.38,32.31 | v42.82,17.22 42.22,17.83 v34.9,17.83
G
  Top 0.152: Q2.3 39.62,57.3 39.62,55.47 34.75,50.6 29.11,50.6 28.04,49.53 A1.11
G_EXT  (via drill 0.3)
  Top 0.152: Q2.1 41,59.44 41.45,59.89 42.06,59.89 v42.37,59.59 | v43.13,58.83 47.09,58.83 48.01,57.91 48.01,52.12 51.82,48.31 51.82,39.47 50.44,38.1 R7.2
  Bottom 0.152: v43.13,58.83 v42.37,59.59
GND  (via drill 0.3)
  Top 0.152: v51.21,47.24 51.21,47.4 50.44,48.16 C3.2 | R10.1 62.18,47.09 62.48,47.4 v62.48,48.46 62.18,48.77 62.18,51.97 R9.1 62.18,52.12 v62.18,53.49 | v41.6,55.93 41.6,57.3 Q2.2 | v42.06,65.38 41.6,65.84 41.6,66.29 Q1.2 | v49.68,56.39 49.23,56.84 49.23,57.3 Q4.2 | v49.07,65.38 49.07,66.29 Q3.2 | v45.11,48.31 44.04,48.31 C2.2 | v62.18,35.05 62.18,36.73 R12.1 | v60.66,41.91 R11.1 | v61.27,54.86 62.03,55.63 62.03,57.15 R4.1 | v60.05,54.86 60.05,57.61 62.03,59.59 62.03,62.18 R3.1 | v54.86,67.21 62.03,67.21 R2.1 | v60.05,72.39 R1.1
  Bottom 0.152: v51.21,47.24 56.08,47.24 58.67,44.65 58.98,44.65 62.48,48.16 v62.48,48.46 | v41.6,55.93 41.6,54.86 42.37,54.1 42.37,53.8 42.22,53.65 | 42.22,53.65 40.54,51.97 36.73,51.97 35.81,52.88 | 35.81,52.88 31.24,52.88 30.48,52.12 A1.14 | 35.81,52.88 35.81,58.83 42.06,65.08 v42.06,65.38 v49.07,65.38 50.9,67.21 v54.86,67.21 v60.05,72.39 | 42.22,53.65 45.11,53.65 | 45.11,53.65 48.77,53.65 49.68,54.56 v49.68,56.39 49.84,56.54 57.15,56.54 58.83,54.86 v60.05,54.86 v61.27,54.86 62.18,53.95 v62.18,53.49 | 45.11,53.65 v45.11,48.31 | A1.41 73.76,46.94 74.83,45.87 74.83,41.45 74.22,40.84 73.61,40.84 72.54,39.78 72.54,38.71 65.53,31.7 65.23,31.7 62.18,34.75 v62.18,35.05 58.22,39.01 58.22,39.93 60.2,41.91 v60.66,41.91
  pour Top: -3.3,81.92 102.49,81.92 102.49,-4.06 0.76,-4.06 -3.3,0
  pour Bottom: -7.11,85.98 106.05,85.98 106.05,-6.73 -7.11,-6.73
GREEN  (via drill 0.3)
  Top 0.152: v77.72,71.78 81.53,75.59 84.28,75.59 L1.P$3 | v74.98,70.87 74.22,70.87 74.07,71.02 63.86,71.02 62.94,70.1 v62.33,70.1 | v61.27,69.04 53.03,69.04 50.9,71.17 43.43,71.17 41.3,69.04 40.08,69.04 39.93,68.89 39.93,67.82 40.69,67.06 42.06,67.06 42.82,66.29 42.82,62.94 39.93,60.05 39.93,58.83 40.69,58.06 v40.69,55.02 | v41.76,53.95 41.76,49.07 41.45,48.77 41.45,45.87 v42.22,45.11 | v42.67,42.37 46.94,38.1 R7.1
  Bottom 0.152: v77.72,71.78 77.11,71.17 75.29,71.17 v74.98,70.87 | v61.27,69.04 v62.33,70.1 | v41.76,53.95 v40.69,55.02 | v42.22,45.11 42.22,42.82 v42.67,42.37
LAD0  (via drill 0.3)
  Top 0.152: v40.69,73.15 52.58,73.15 v53.34,73.91 | v55.93,76.5 76.2,76.5 77.42,75.29 77.42,74.22 v77.11,73.91 | v88.54,62.48 89.61,62.48 93.42,58.67 U$2.36
  Bottom 0.152: v40.69,73.15 40.69,72.24 30.79,62.33 30.48,62.33 A1.22 | v53.34,73.91 53.34,74.22 55.63,76.5 v55.93,76.5 | v88.54,62.48 v77.11,73.91
LAD1  (via drill 0.3)
  Top 0.152: v31.55,65.99 31.55,68.89 35.2,72.54 55.32,72.54 58.06,75.29 60.2,75.29 60.81,74.68 70.71,74.68 v71.02,74.37 | v83.06,72.39 85.8,72.39 93.42,64.77 93.42,63.86 U$2.40
  Bottom 0.152: A1.24 30.48,65.08 31.39,65.99 v31.55,65.99 | v71.02,74.37 73.15,76.5 76.5,76.5 77.57,77.57 77.88,77.57 v83.06,72.39
LAD2  (via drill 0.3)
  Top 0.152: v26.36,60.5 26.67,60.81 26.67,65.08 27.89,66.29 27.89,67.21 A1.25 | v25.45,56.84 25.45,55.47 27.74,53.19 30.94,53.19 v32.31,51.82 | v41.45,41.15 42.37,41.15 49.23,34.29 49.23,29.72 v48.92,29.41 | v63.7,13.41 63.7,12.95 65.38,11.28 76.66,11.28 93.42,28.04 U$2.12
  Bottom 0.152: v26.36,60.5 26.36,58.83 26.67,58.52 26.67,58.06 v25.45,56.84 | v32.31,51.82 32.31,51.05 38.86,44.5 39.62,44.5 40.39,43.74 40.39,42.22 v41.45,41.15 | v48.92,29.41 48.92,28.19 v63.7,13.41
LAD3  (via drill 0.3)
  Top 0.152: v39.17,74.52 39.47,74.52 40.69,75.74 53.34,75.74 55.02,74.07 v55.17,74.07 | v56.39,72.85 58.37,72.85 62.64,68.58 65.68,68.58 65.99,68.28 65.99,60.96 65.68,60.66 65.68,60.35 66.14,59.89 66.9,59.89 v73,65.99 | v74.52,65.84 75.29,65.84 75.59,66.14 78.94,66.14 83.36,70.56 v86.41,70.56 | v88.54,68.43 88.54,66.14 93.42,61.27 U$2.38
  Bottom 0.152: v39.17,74.52 39.17,74.37 30.79,65.99 28.96,65.99 28.04,65.08 28.04,64.77 A1.23 | v56.39,72.85 v55.17,74.07 | v73,65.99 74.37,65.99 v74.52,65.84 | v88.54,68.43 v86.41,70.56
LCLK  (via drill 0.3)
  Top 0.152: v38.1,57.15 36.58,57.15 32.92,60.81 30.02,60.81 29.41,60.2 29.41,59.59 28.04,58.22 28.04,57.15 A1.17 | v44.2,60.35 45.57,60.35 48.31,63.09 48.31,67.06 47.55,67.82 47.55,68.89 47.7,69.04 48.77,69.04 56.08,61.72 56.08,51.97 60.66,47.4 60.66,45.57 v62.79,43.43 | v69.49,38.56 72.85,35.2 85.5,35.2 v91.14,40.84
  Bottom 0.152: v38.1,57.15 38.71,57.15 42.67,61.11 43.43,61.11 v44.2,60.35 | v62.79,43.43 65.08,43.43 69.49,39.01 v69.49,38.56 | v91.14,40.84 93.57,43.28 U$2.24
LED1  (via drill 0.3)
  Top 0.152: v39.93,20.27 37.34,20.27 LED1.A | v45.11,17.37 45.41,17.37 45.72,17.68 60.05,17.68 68.43,26.06 v68.43,29.26 | v74.98,35.81 75.59,35.81 75.74,35.66 82.3,35.66 v87.94,41.3 | v92.05,49.07 92.35,49.07 93.12,49.84 96.47,49.84 97.23,50.6 97.23,57.45 96.16,58.52 U$2.35
  Bottom 0.152: v39.93,20.27 42.22,20.27 v45.11,17.37 | v74.98,35.81 v68.43,29.26 | v87.94,41.3 87.94,44.96 v92.05,49.07
LED2  (via drill 0.3)
  Top 0.152: v59.13,33.53 58.83,33.53 48.77,23.47 48.77,20.42 LED2.A | v58.37,34.29 58.37,36.12 61.72,39.47 62.18,39.47 62.79,40.08 v62.79,40.23 | v64.31,40.23 64.62,40.23 65.08,40.69 66.29,40.69 69.8,44.2 71.78,44.2 73.15,45.57 76.35,45.57 78.49,47.7 v78.49,49.38 | v80.77,51.66 83.52,51.66 85.19,53.34 85.19,54.56 85.65,55.02 92.96,55.02 93.14,54.84 94.82,54.84 96.01,53.65 U$2.31
  Bottom 0.152: v58.37,34.29 v59.13,33.53 | v64.31,40.23 v62.79,40.23 | v80.77,51.66 v78.49,49.38
LED3  (via drill 0.3)
  Top 0.152: v82.14,52.27 82.14,54.1 83.97,55.93 86.26,55.93 87.94,57.61 87.94,69.34 87.63,69.65 85.95,69.65 85.8,69.49 85.8,69.19 84.12,67.51 81.08,67.51 79.4,65.84 75.74,65.84 75.13,65.23 75.13,64.62 74.22,63.7 73.15,63.7 69.49,60.05 69.49,59.59 63.7,53.8 63.7,39.93 63.55,39.78 63.55,35.66 58.98,31.09 58.98,20.42 LED3.A | v83.36,51.05 84.58,51.05 90.53,45.11 92.66,45.11 93.42,45.87 U$2.26
  Bottom 0.152: v83.36,51.05 v82.14,52.27
LED_PW
  Top 0.152: PWR.A 15.7,74.83 15.7,73 15.24,72.54 15.24,72.08 15.7,71.63 15.7,71.02 7.77,63.09 7.77,53.49 6.25,51.97 5.49,51.97 1.52,48.01 1.52,10.97 11.28,1.22 17.07,1.22 19.66,3.81 37.03,3.81 37.49,3.35 73.76,3.35 93.42,23.01 U$2.8
LED_S1
  Top 0.152: LEDS1.A 84.43,68.58 85.8,69.95 87.78,69.95 92.35,65.38 92.35,63.25 93.27,62.33 96.62,62.33 97.54,61.42 97.54,39.78 96.16,38.41 U$2.19
LED_S2
  Top 0.152: LEDS2.A 83.21,63.4 83.21,60.2 79.86,56.84 79.86,51.36 86.41,44.81 90.53,44.81 93.27,42.06 94.94,42.06 96.01,41 U$2.21
LED_S3  (via drill 0.3)
  Top 0.152: v86.26,45.72 85.95,45.72 80.16,51.51 80.16,52.58 83.21,55.63 83.21,58.37 LEDS3.A | v85.34,44.65 85.65,44.65 86.11,44.2 89.76,44.2 v90.98,42.98 | v92.05,44.04 92.51,44.04 93.12,44.65 94.79,44.65 96.01,43.43 U$2.23
  Bottom 0.152: v86.26,45.72 85.34,44.81 v85.34,44.65 | v92.05,44.04 v90.98,42.98
LED_S4
  Top 0.152: LEDS4.A 83.36,53.34 85.65,55.63 91.29,55.63 93.12,57.45 94.03,57.45 94.79,58.22 94.79,59.89 96.01,61.11 U$2.37
LFRAME  (via drill 0.3)
  Top 0.152: 39.93,17.68 40.54,18.29 40.54,30.18 40.39,30.33 40.39,41.76 v41,42.37 | 39.93,17.68 38.41,16.15 33.38,16.15 27.13,9.91 24.99,9.91 17.68,2.59 15.24,2.59 TP1.TP | v35.66,52.27 35.66,54.41 30.48,59.59 A1.20 | v90.07,46.33 85.5,50.9 85.5,54.41 85.8,54.71 87.78,54.71 88.85,53.65 93.42,53.65 U$2.32 | v81.69,33.38 81.69,29.57 81.84,29.41 81.84,26.21 69.95,14.33 54.71,14.33 52.73,12.34 v52.73,11.43 | v51.97,10.67 49.07,10.67 46.48,13.26 46.48,14.02 44.65,15.85 41.76,15.85 39.93,17.68
  Bottom 0.152: v41,42.37 41,46.94 v35.66,52.27 | v90.07,46.33 90.07,41.76 v81.69,33.38 | v51.97,10.67 v52.73,11.43
N$1  (via drill 0.3)
  Top 0.152: v39.17,34.9 39.17,30.48 33.83,25.15 33.83,20.42 LED1.C | v45.57,41.3 45.57,43.74 49.53,47.7 49.53,50.14 46.48,53.19 v46.48,58.22 | v61.72,70.71 63.09,70.71 64.77,72.39 R1.2
  Bottom 0.152: v45.57,41.3 v39.17,34.9 | v46.48,58.22 48.16,58.22 48.46,57.91 48.92,57.91 v61.72,70.71
N$2  (via drill 0.3)
  Top 0.152: LEDS1.C 85.65,68.58 83.21,66.14 80.16,66.14 77.42,63.4 75.74,63.4 74.95,62.61 74.95,61.85 74.04,60.94 73.28,60.94 v70.41,58.06 | v69.19,56.84 69.19,56.39 64.92,52.12 R9.2
  Bottom 0.152: v69.19,56.84 v70.41,58.06
N$3
  Top 0.152: LED2.C 45.26,20.42 59.44,34.59 59.44,36.73 61.87,39.17 62.48,39.17 63.4,40.08 63.4,55.02 63.55,55.17 63.55,64.31 64.92,65.68 64.92,67.21 R2.2
N$4  (via drill 0.3)
  Top 0.152: v54.41,28.35 55.32,27.43 55.32,20.42 LED3.C | v53.19,29.57 53.19,32.16 60.05,39.01 v60.05,47.24 | v60.96,48.31 60.96,49.07 60.66,49.38 60.66,57.76 v62.94,60.05 | v64.16,60.81 64.16,61.57 64.77,62.18 R3.2
  Bottom 0.152: v53.19,29.57 v54.41,28.35 | v60.05,47.24 60.96,48.16 v60.96,48.31 | v62.94,60.05 63.4,60.05 v64.16,60.81
N$5  (via drill 0.3)
  Top 0.152: v56.39,75.29 53.34,78.33 16.76,78.33 13.41,74.98 12.34,74.98 PWR.C | v57.61,74.07 57.61,73.76 58.22,73.15 58.52,73.15 62.79,68.89 65.84,68.89 66.29,68.43 v66.29,60.5 | v65.53,59.74 65.53,57.76 R4.2 | R4.2
  Bottom 0.152: v57.61,74.07 v56.39,75.29 | v65.53,59.74 v66.29,60.5
N$10
  Top 0.152: LEDS2.C 86.72,63.55 85.65,63.55 83.36,65.84 80.31,65.84 77.42,62.94 77.42,61.87 76.66,61.11 75.59,61.11 74.83,60.35 74.83,56.69 73.91,55.78 73.3,55.78 64.92,47.4 64.92,47.09 R10.2
N$12
  Top 0.152: R11.2 66.45,41.91 72.69,48.16 73.91,48.16 74.83,49.07 74.83,49.68 75.74,50.6 76.81,50.6 77.27,50.14 77.57,50.14 78.03,50.6 78.03,54.41 76.66,55.78 76.05,55.78 75.13,56.69 75.13,60.2 75.74,60.81 76.81,60.81 77.72,61.72 77.72,62.79 80.47,65.53 83.21,65.53 84.43,64.31 84.43,64.01 86.72,61.72 86.72,58.52 LEDS3.C
N$14
  Top 0.152: LEDS4.C 86.87,53.34 93.12,47.09 94.03,47.09 94.79,46.33 94.79,45.57 95.71,44.65 96.47,44.65 97.23,43.89 97.23,40.39 96.47,39.62 93.12,39.62 90.83,41.91 77.88,41.91 76.5,40.54 69.19,40.54 65.53,36.88 64.92,36.88 R12.2
N$37  (via drill 0.3)
  Top 0.152: v47.24,56.39 47.24,57.3 Q4.3 | v45.41,60.96 45.41,61.87 48.01,64.47 48.01,66.75 44.2,70.56 v44.04,70.56 | v32.77,75.89 31.55,75.89 30.94,76.5 25.91,76.5 25.45,76.05 25.45,75.74 26.21,74.98 27.89,74.98 A1.31
  Bottom 0.152: v47.24,56.39 47.24,56.69 45.41,58.52 v45.41,60.96 | v44.04,70.56 37.8,76.81 33.68,76.81 v32.77,75.89
N$51
  Top 0.152: Q4.1 48.92,59.44 55.47,52.88 55.47,51.66 55.93,51.21 55.93,44.65 52.43,41.15 52.43,36.12 50.29,33.98 49.99,33.98 49.53,34.44 49.53,38.71 48.46,39.78 45.87,39.78 43.28,42.37 43.28,42.52 42.82,42.98 40.84,42.98 40.08,42.22 40.08,30.18 40.23,30.02 40.23,25.15 35.51,20.42 35.51,17.68 34.59,16.76 30.33,16.76 27.43,13.87 20.73,13.87 19.36,12.5 19.36,5.18 17.68,3.5 13.72,3.5 12.8,2.59 D0.1
NC
  Top 0.152: A1.6 29.57,41.91 28.5,40.84 21.49,40.84 21.34,40.69 A2.13
NC_2  (via drill 0.3)
  Top 0.152: A1.8 30.48,43.43 31.55,42.37 31.55,41.45 30.94,40.84 28.96,40.84 28.65,40.54 26.67,40.54 v24.84,38.71 | v25.91,37.64 21.34,33.07 A2.10
  Bottom 0.152: v25.91,37.64 v24.84,38.71
R
  Top 0.152: A1.12 34.14,49.53 40.39,55.78 40.39,57.91 39.62,58.67 39.62,66.29 Q1.3
R_EXT  (via drill 0.3)
  Top 0.152: v42.98,60.2 43.13,60.35 43.13,66.45 41.3,68.28 40.69,68.28 Q1.1 | v48.62,54.25 48.62,51.97 52.43,48.16 v52.43,42.37 | v53.65,41.15 56.69,38.1 R8.2
  Bottom 0.152: v42.98,60.2 42.98,59.89 v48.62,54.25 | v53.65,41.15 v52.43,42.37
RECOVER  (via drill 0.3)
  Top 0.152: v35.2,48.92 35.97,48.16 35.97,38.1 R5.1 36.12,38.1 v36.12,36.27 | v32.92,51.21 31.24,51.21 30.94,50.9 29.11,50.9 A1.13 | v78.49,43.28 85.04,43.28 RECOVERY.2 | v77.72,44.04 77.42,44.04 76.66,43.28 70.41,43.28 67.21,40.08 64.92,40.08 v64.16,39.32 | v62.03,40.08 61.72,39.78 61.57,39.78 53.8,32 53.8,29.41 52.88,28.5 43.89,28.5 v42.67,29.72
  Bottom 0.152: v32.92,51.21 v35.2,48.92 | v77.72,44.04 v78.49,43.28 | v64.16,39.32 63.86,39.62 62.48,39.62 v62.03,40.08 | v36.12,36.27 v42.67,29.72
RED  (via drill 0.3)
  Top 0.152: v77.42,68.28 83.67,74.52 84.28,74.52 L1.P$1 | v62.94,58.67 62.94,58.37 63.25,58.06 63.25,55.32 60.96,53.03 60.96,49.53 61.72,48.77 v61.72,48.46 | v58.83,45.26 58.83,41 57.61,39.78 57.61,37.49 57.3,37.19 56.08,37.19 55.17,38.1 R8.1
  Bottom 0.152: v77.42,68.28 77.04,68.28 76.73,68.58 72.85,68.58 v62.94,58.67 | v61.72,48.46 61.72,48.16 v58.83,45.26
RST  (via drill 0.3)
  Top 0.152: v36.73,57.76 33.38,61.11 29.87,61.11 28.5,59.74 28.04,59.74 A1.19 | v41.15,53.34 41.15,44.96 v41.6,44.5 | v41.76,42.37 40.69,41.3 40.69,30.48 41.15,30.02 v41.15,29.72 | v41.91,28.96 41.91,28.65 41.15,27.89 41.15,17.37 42.06,16.46 45.41,16.46 46.02,17.07 60.81,17.07 77.72,33.98 86.72,33.98 89.76,37.03 96.47,37.03 97.23,36.27 97.23,35.36 96.32,34.44 94.64,34.44 93.57,33.38 U$2.16
  Bottom 0.152: v41.15,53.34 v36.73,57.76 | v41.6,44.5 41.6,42.52 v41.76,42.37 | v41.91,28.96 v41.15,29.72
SW_P1  (via drill 0.3)
  Top 0.152: P1.1 32.31,12.5 38.71,12.5 P1.2 | v97.38,27.13 97.38,25.3 96.32,24.23 90.53,24.23 75.74,9.45 v43.89,9.45
  Bottom 0.152: v97.38,27.13 97.69,27.43 97.69,32.61 98.6,33.53 98.6,33.83 98.3,34.14 98.3,54.25 96.47,56.08 96.16,56.08 U$2.33 | v43.89,9.45 43.13,10.21 40.08,10.21 39.47,10.82 39.47,11.73 38.86,12.34 P1.2
SW_P2  (via drill 0.3)
  Top 0.152: v90.68,45.72 90.68,46.48 85.8,51.36 85.8,54.25 85.95,54.41 87.63,54.41 89.61,52.43 93.73,52.43 95.1,51.05 96.01,51.05 U$2.29 | v75.13,26.06 72.85,26.06 61.42,14.63 52.43,14.63 50.29,12.5 P2.2
  Bottom 0.152: P2.1 43.74,12.5 45.41,12.5 46.18,13.26 48.31,13.26 49.07,12.5 50.14,12.5 P2.2 | v90.68,45.72 90.68,43.43 90.37,43.13 90.37,41.3 v75.13,26.06
SW_P3  (via drill 0.3)
  Top 0.152: P3.1 55.17,12.5 61.57,12.5 P3.2 61.72,12.5 63.25,14.02 70.1,14.02 82.14,26.06 82.14,29.41 84.58,31.85 v84.58,33.38 | v92.35,39.62 90.83,39.62 v86.56,35.36
  Bottom 0.152: v92.35,39.62 92.96,40.23 92.96,40.39 93.42,40.84 U$2.22 | v84.58,33.38 v86.56,35.36
SW_P4
  Top 0.152: P4.1 66.6,12.5 73,12.5 P4.2 73.15,12.5 82.45,21.79 82.45,29.26 88.85,35.66 93.42,35.66 U$2.18
TCK  (via drill 0.3)
  Top 0.152: v33.53,69.65 37.49,69.65 40.84,66.29 40.84,65.84 v42.22,64.47 | v48.62,58.52 49.38,58.52 55.17,52.73 55.17,51.21 v55.32,51.05 | v56.84,50.44 56.84,48.01 59.44,45.41 59.44,41.15 58.83,40.54 v58.83,39.78 | v86.56,34.59 v64.47,34.59 | v87.78,33.38 89.15,33.38 93.12,29.41 94.79,29.41 96.01,28.19 U$2.11
  Bottom 0.152: A1.30 30.79,72.39 v33.53,69.65 | v42.22,64.47 42.67,64.47 v48.62,58.52 | v55.32,51.05 56.24,51.05 v56.84,50.44 | v58.83,39.78 59.28,39.78 v64.47,34.59 | v87.78,33.38 v86.56,34.59
TDI  (via drill 0.3)
  Top 0.152: v32.16,68.73 32.16,69.04 33.68,70.56 v42.06,70.56 | v56.24,77.27 75.89,77.27 v76.05,77.11 | v84.89,73 87.94,73 96.01,64.92 96.47,64.92 97.84,63.55 97.84,35.05 96.16,33.38 U$2.15
  Bottom 0.152: v32.16,68.73 31.85,68.73 30.79,69.8 30.48,69.8 A1.28 | v42.06,70.56 42.82,70.56 43.74,69.65 47.09,69.65 55.17,77.72 55.78,77.72 v56.24,77.27 | v76.05,77.11 76.66,77.11 77.42,77.88 80.01,77.88 v84.89,73
TDO  (via drill 0.3)
  Top 0.152: v78.03,64.77 76.96,63.7 75.59,63.7 74.22,62.33 73.76,62.33 A1.53 | v79.7,63.09 79.7,57.15 79.55,57 79.55,51.21 86.26,44.5 90.22,44.5 91.59,43.13 v91.59,42.06 | v91.14,33.98 93.27,31.85 94.94,31.85 96.01,30.79 U$2.13
  Bottom 0.152: v79.7,63.09 v78.03,64.77 | v91.59,42.06 90.53,41 90.53,34.59 v91.14,33.98
TMS  (via drill 0.3)
  Top 0.152: v24.54,72.39 21.34,72.39 19.05,70.1 15.7,70.1 8.38,62.79 8.38,48.92 6.4,46.94 5.64,46.94 v3.66,44.96 | v2.13,43.43 2.13,19.96 5.64,16.46 6.71,16.46 v18.29,4.88 | v35.81,3.2 v19.96,3.2 | v36.58,2.44 73.76,2.44 93.27,21.95 94.94,21.95 96.01,23.01 U$2.7
  Bottom 0.152: v24.54,72.39 A1.29 | v2.13,43.43 v3.66,44.96 | v19.96,3.2 v18.29,4.88 | v36.58,2.44 v35.81,3.2

### Text on the board
tPlace: + | Chip Edition
bPlace: Also includes work from Ryzee119 / https://github.com/Ryzee119/OpenXenium | Designed for use with the Xenium-Programmer project / https://github.com/kooscode/xenium-programmer | dtomcat | Released under / CERN OHL v1.2